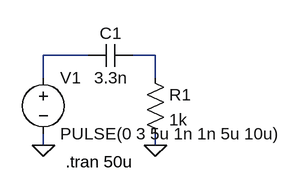
[diagram p0: schematic Draft4.asc]
Draft4.asc, the LTspice schematic file:
Version 4
SHEET 1 880 680
WIRE 112 96 48 96
WIRE 208 96 176 96
WIRE 48 128 48 96
WIRE 208 128 208 96
WIRE 48 224 48 208
WIRE 208 224 208 208
FLAG 48 224 0
FLAG 208 224 0
SYMBOL voltage 48 112 R0
WINDOW 123 0 0 Left 0
WINDOW 39 0 0 Left 0
SYMATTR InstName V1
SYMATTR Value PULSE(0 3 5u 1n 1n 5u 10u)
SYMBOL cap 176 80 R90
WINDOW 0 0 32 VBottom 2
WINDOW 3 32 32 VTop 2
SYMATTR InstName C1
SYMATTR Value 3.3n
SYMBOL res 192 112 R0
SYMATTR InstName R1
SYMATTR Value 1k
TEXT 80 248 Left 2 !.tran 50u

The netlist it stands for:
* Draft4.asc
V1 N001 0 PULSE(0 3 5u 1n 1n 5u 10u)
C1 N002 N001 3.3n
R1 N002 0 1k
.tran 50u
.backanno
.end